# EAGLE design pH-meter-v1-4 (EAGLE 6.2)
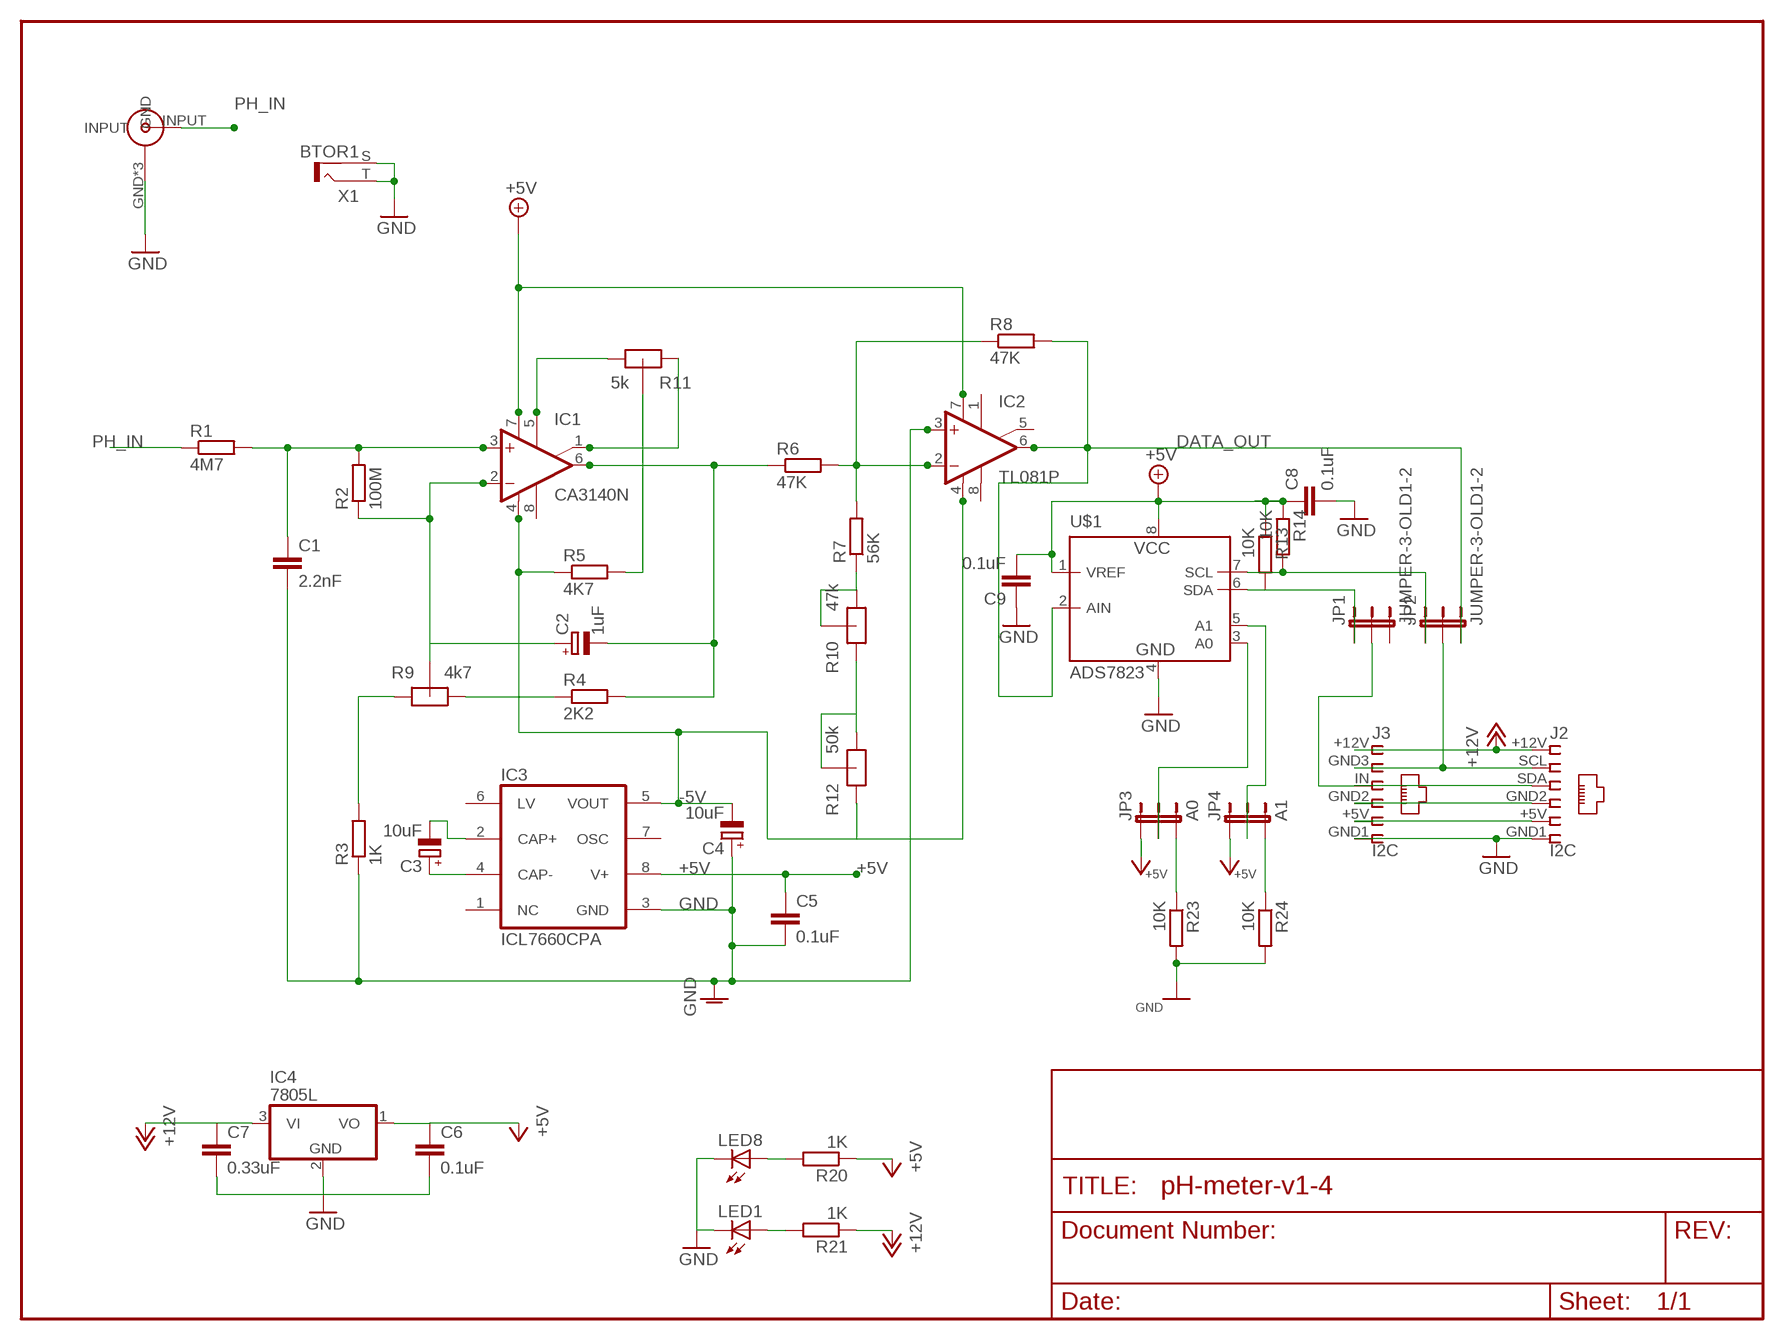
[diagram p0: schematic, sheet 1]

## Parts
C1  2.2nF  C-EU025-030X050  [C025-030X050]
C2  1uF  CPOL-EUE2-4  [E2-4]
C3  10uF  CPOL-EUE2-4  [E2-4]
C4  10uF  CPOL-EUE2-4  [E2-4]
C5  0.1uF  C-EU025-030X050  [C025-030X050]
C6  0.1uF  C-EU025-030X050  [C025-030X050]
C7  0.33uF  C-EU025-030X050  [C025-030X050]
C8  0.1uF  C-EU025-030X050  [C025-030X050]
C9  0.1uF  C-EU025-030X050  [C025-030X050]
IC1  CA3140N  [DIL08]
IC2  TL081P  [DIL08]
IC3  ICL7660CPA  [DIL08]
IC4  7805L  [TO92]
J2  I2C  RJ12STRAIGHT-I2C  [RJ12-STRAIGHT-I2C]
J3  I2C  RJ12STRAIGHT-ANALOG  [RJ12-STRAIGHT-ANALOG]
JP1  JUMPER-3-OLD1-2  [SJ_3_PASTE1&2]
JP2  JUMPER-3-OLD1-2  [SJ_3_PASTE1&2]
JP3  A0  JUMPER-3-OLD1-2  [SJ_3_PASTE1&2]
JP4  A1  JUMPER-3-OLD1-2  [SJ_3_PASTE1&2]
LED1  LED3MM  [LED3MM]
LED8  LED3MM  [LED3MM]
R1  4M7  R-EU_0309/12  [0309/12]
R2  100M  R-EU_0309/12  [0309/12]
R3  1K  R-EU_0309/12  [0309/12]
R4  2K2  R-EU_0309/12  [0309/12]
R5  4K7  R-EU_0309/12  [0309/12]
R6  47K  R-EU_0309/12  [0309/12]
R7  56K  R-EU_0309/12  [0309/12]
R8  47K  R-EU_0309/12  [0309/12]
R9  4k7  POT-METER_ALPS  [POT-METER_ALPS]
R10  47k  POT-METER_ALPS  [POT-METER_ALPS]
R11  5k  POT-METER_ALPS  [POT-METER_ALPS]
R12  50k  POT-METER_ALPS  [POT-METER_ALPS]
R13  10K  R-EU_R1206  [R1206]
R14  10K  R-EU_R1206  [R1206]
R20  1K  R-EU_0309/12  [0309/12]
R21  1K  R-EU_0309/12  [0309/12]
R23  10K  R-EU_0309/12  [0309/12]
R24  10K  R-EU_0309/12  [0309/12]
U$1  ADS7823  [MSOP8]
U$2  BNC_IN  BND_VERTICAL_AMPHENOL  [BNC_VERTICAL_AMPHENOL]
X1  BTOR1  [BTOR1]

## Nets
+5V: C5.1 C6.1 C8.1 C9.2 IC1.7(V+) IC2.7(V+) IC3.8(V+) IC4.1(VO) JP3.1 JP4.1 R13.1 R14.1 R20.1 U$1.1(VREF) U$1.8(VCC)
+12V [highpower]: C7.1 IC4.3(VI) J2.+12V J3.+12V R21.1
-5V: C4.- IC1.4(V-) IC2.4(V-) IC3.5(VOUT) R5.1 R12.P$1(IN)
ASDF: R3.2 R9.P$1(IN)
DATA_OUT [smd]: IC2.6(OUT) JP2.3 R8.2 U$1.2(AIN)
GND [highpower]: C1.2 C4.+ C5.2 C6.2 C7.2 C8.2 C9.1 IC2.3(+IN) IC3.3(GND) IC4.2(GND) J2.GND1 J2.GND2 J3.GND1 J3.GND2 LED1.K(C) LED8.K(C) R3.1 R23.2 R24.2 U$1.4(GND) U$2.GND U$2.GND_1(GND) U$2.GND_2(GND) X1.S X1.T
N$1: C1.1 IC1.3(+IN) R1.2 R2.2
N$2: C2.+ IC1.2(-IN) R2.1 R9.P$2(DRIVE)
N$3: R5.2 R11.P$2(DRIVE)
N$4: IC1.5(ON) R11.P$3(OUT)
N$5: IC1.1(ON/CMP) R11.P$1(IN)
N$6: C2.- IC1.6(OUT) R4.2 R6.1
N$7: R4.1 R9.P$3(OUT)
N$8: R7.1 R10.P$2(DRIVE) R10.P$3(OUT)
N$10: R10.P$1(IN) R12.P$2(DRIVE) R12.P$3(OUT)
N$11: C3.- IC3.2(CAP+)
N$12: IC2.2(-IN) R6.2 R7.2 R8.1
N$13: C3.+ IC3.4(CAP-)
N$14 [smd]: JP1.1 R13.2 U$1.6(SDA)
N$15 [smd]: JP2.1 R14.2 U$1.7(SCL)
N$18 [smd]: JP3.3 R23.1
N$19 [smd]: JP4.3 R24.1
N$20: LED8.A R20.2
N$21 [smd]: JP3.2 U$1.3(A0)
N$22 [smd]: JP4.2 U$1.5(A1)
N$23: LED1.A R21.2
PH_IN: R1.1 U$2.INPUT
RJ12-5V [highpower]: J2.+5V J3.+5V
SCL [smd]: J2.SCL J3.GND3 JP2.2
SDA [smd]: J2.SDA J3.IN JP1.2
Unconnected: IC1.8(CMP) IC2.1(ON1) IC2.5(ON2) IC2.8(OPT) IC3.1(NC) IC3.6(LV) IC3.7(OSC) JP1.3 X1.S@1 X1.S@2 X1.S@3

## Library data of the parts
C1 C5-C9 = resistor:C-EU: CAPACITOR, European symbol
C2-C4 = resistor:CPOL-EU: POLARIZED CAPACITOR, European symbol
IC1 = linear:CA3140: OP AMP
IC2 = linear:TL081: OP AMP
IC3 = maxim:ICL7660CPA: VOLTAGE CONVERTER; MF: INTERSIL; MPN: ICL7660CPA; OC_FARNELL: 1018170; OC_NEWARK: 06F7441
IC4 = linear:78*: Positive VOLTAGE REGULATOR Source: http://cache.national.com/ds/LM/LM78L05.pdf http://www.fairchildsemi.com/ds/LM/LM7805.pdf
J2 J3 = lpatiny:RJ12: CORCOM Modular RJ Jacks No Shield Source: www.tycoelectronics.com .. ENG_DS_1654001_1099_RJ_L_0507.pdf
JP1-JP4 = SparkFun:JUMPER-3-OLD
LED1 LED8 = lpatiny:LED3MM
R1-R8 R13 R14 R20 R21 R23 R24 = rcl:R-EU_: RESISTOR, European symbol
R9-R12 = lpatiny:POT-METER_ALPS
U$1 = lpatiny:ADS7823
U$2 = lpatiny:BND_VERTICAL_AMPHENOL
X1 = con-lumberg:BTOR1: RCA connectors according to JEITA RC-5231 Cinch RCA-Einbaukupplung nach JEITA RC-5231, stehende Ausführung Source: http://www.lumberg.de/Produkte/PDFs/BTOR1.pdf; MPN: BTOR 1; OC_FARNELL: 1217030; OC_NEWARK: 96K7172

## Net classes
0 default: width 0.457 mm
1 smd: width 0.203 mm
2 highpower: width 0.61 mm

## Board
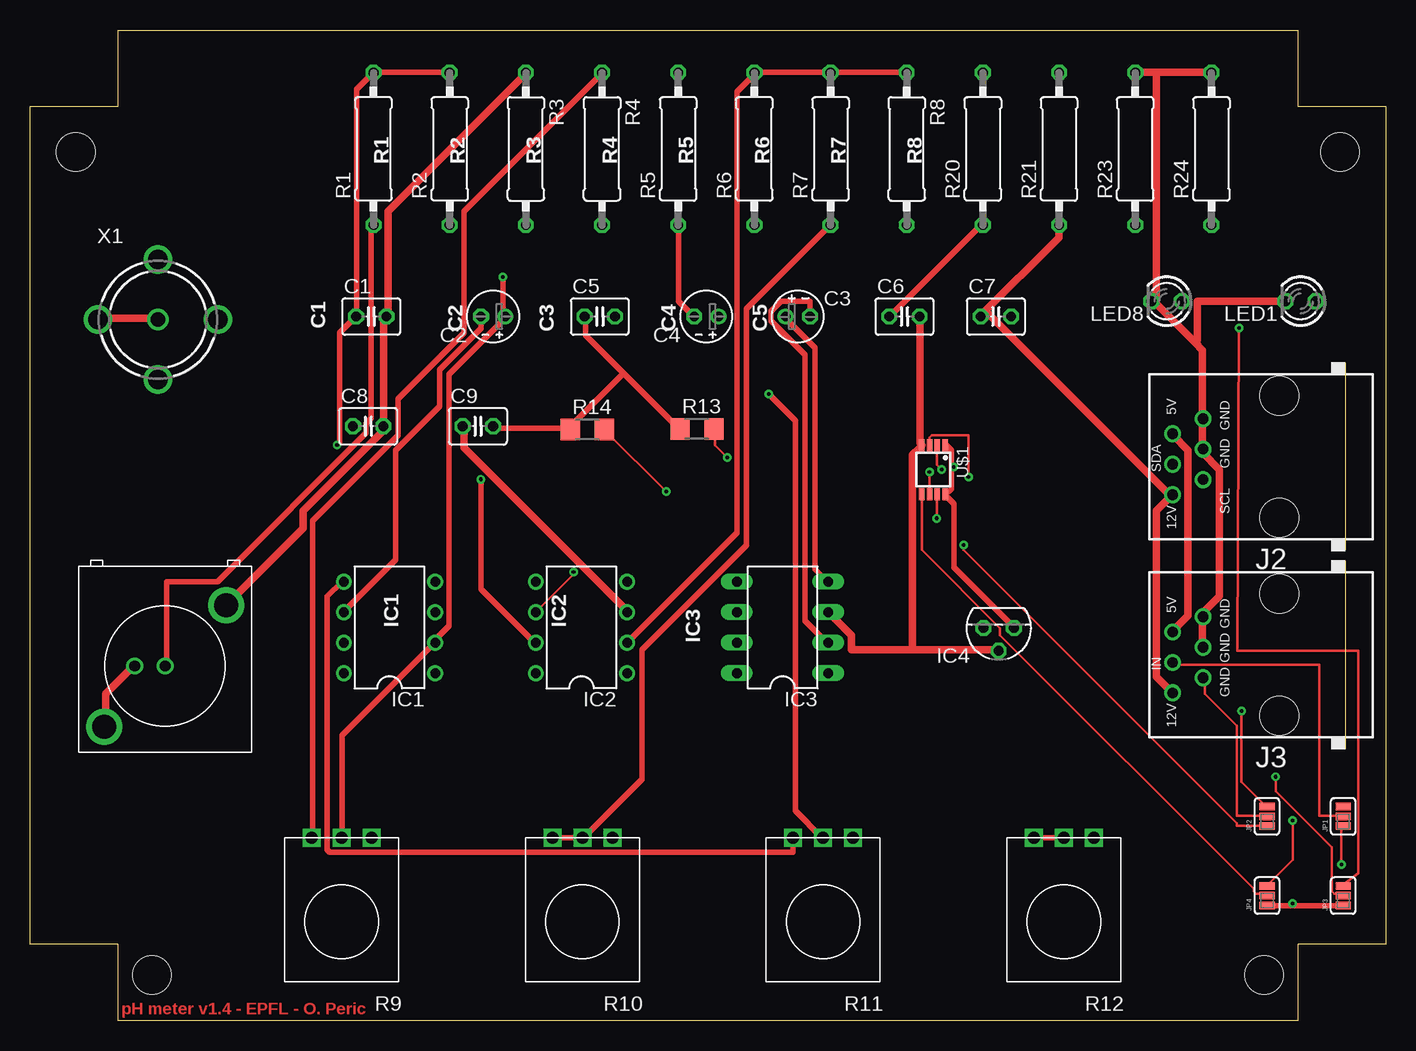
[diagram p1: board, top side]
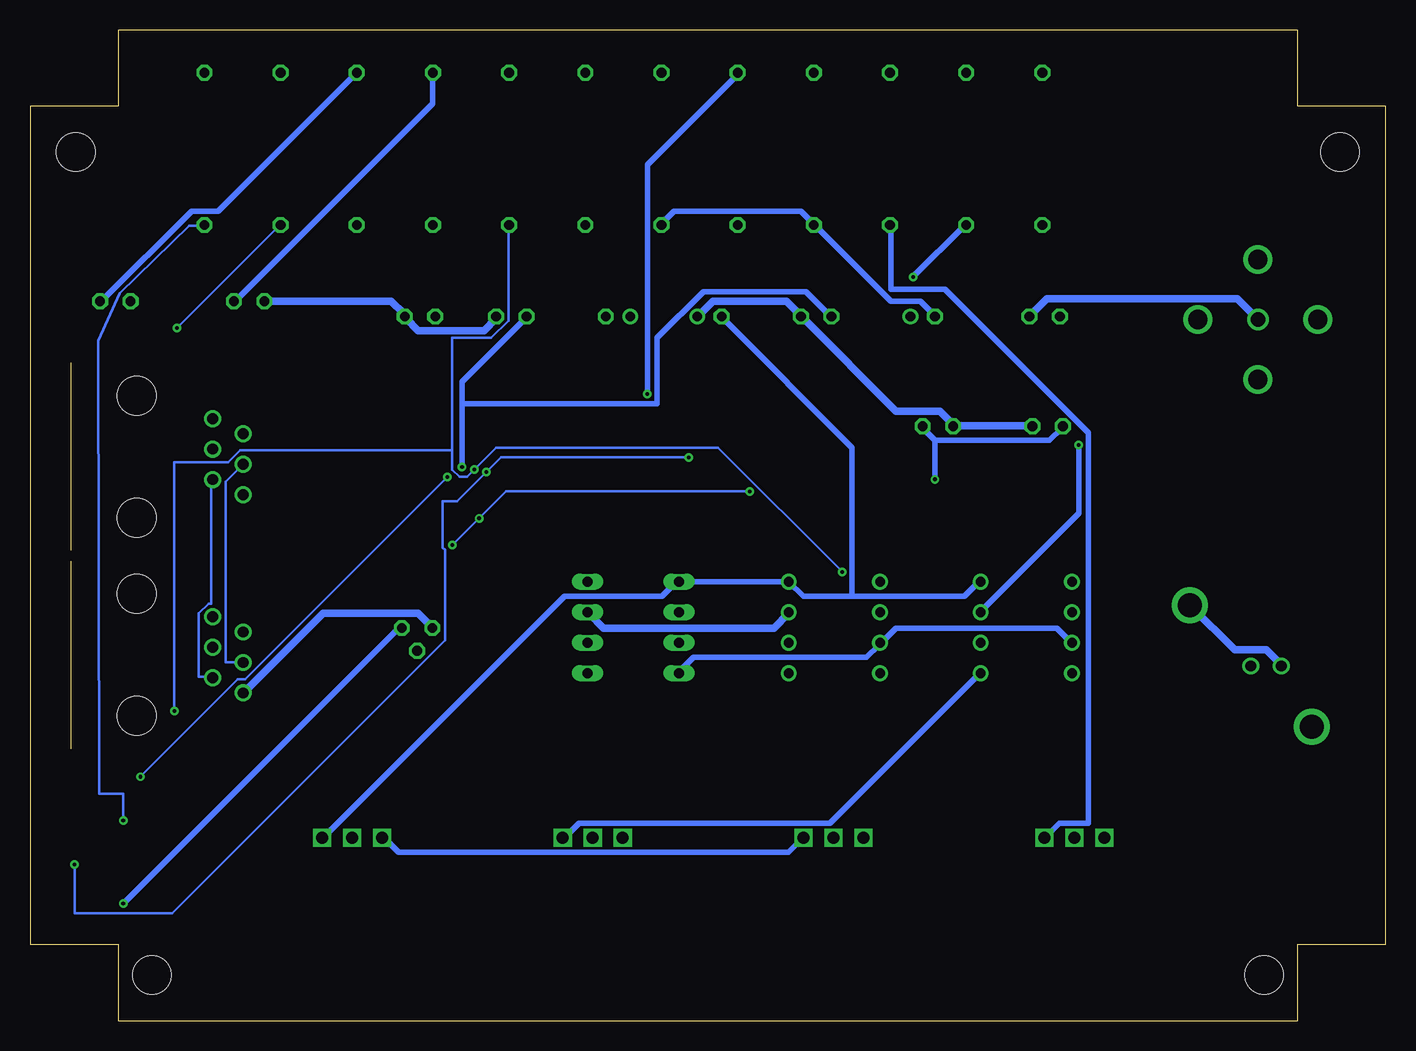
[diagram p2: board, bottom side, seen from below]

Size 113.03 x 82.55 mm. Coordinates in mm from the lower left corner, seen from the top.
Outline: 0,76.2 7.35,76.2 7.35,82.55 105.68,82.55 105.68,76.2 113.03,76.2 113.03,6.35 105.68,6.35 105.68,0 7.35,0 7.35,6.35 0,6.35 0,76.2
Copper layers (1*16): Top 0.035mm / dielectric 1.5mm / Bottom 0.035mm
Design rules: minimum track width 0.15mm, minimum drill 0.3mm, track to track 0.2mm, track to pad 0.2mm, pad to pad 0.2mm, via to via 0.2mm, smd to smd 0.2mm, copper to edge 1mm, drill to drill 0.3mm, minimum pad ring 10mil, minimum via ring 8mil, stop-mask expansion 1mil, vias tented up to drill 0mil, thermal gap 10mil
Holes 3.2 mm at 3.81,72.39 10.16,3.81 102.87,3.81 109.22,72.39
Milling: 12 lines

### Footprints (pad centres in the part's own frame; a part is rotated, then mirrored left to right if it is on the bottom)
C025-030X050 = drill 0.813 octagon: 1 -1.27,0; 2 1.27,0
E2-4 = drill 0.813 pad 1.27: + -1.016,0 | drill 0.813 pad 1.27 octagon: - 1.016,0
DIL08 = drill 0.813 pad 1.27: 1 -3.81,-3.81; 2 -1.27,-3.81; 3 1.27,-3.81; 4 3.81,-3.81; 5 3.81,3.81; 6 1.27,3.81; 7 -1.27,3.81; 8 -3.81,3.81
DIL08' = drill 0.813 long: 1 -3.81,-3.81; 2 -1.27,-3.81; 3 1.27,-3.81; 4 3.81,-3.81; 5 3.81,3.81; 6 1.27,3.81; 7 -1.27,3.81; 8 -3.81,3.81
TO92 = drill 0.813 octagon: 1 -1.27,0; 2 0,1.905; 3 1.27,0
RJ12-STRAIGHT-I2C = drill 0.9 pad 1.4: +5V 1.905,8.89; +12V -3.175,8.89; GND1 3.175,6.35; GND2 0.635,6.35; SCL -1.905,6.35; SDA -0.635,8.89 | hole 3.251: -5.08,0; 5.08,0
RJ12-STRAIGHT-ANALOG = drill 0.9 pad 1.4: +5V 1.905,8.89; +12V -3.175,8.89; GND1 3.175,6.35; GND2 0.635,6.35; GND3 -1.905,6.35; IN -0.635,8.89 | hole 3.251: -5.08,0; 5.08,0
SJ_3_PASTE1&2 = smd 0.635 x 1.27: 1 -0.813,0; 2 0,0; 3 0.813,0
LED3MM = drill 0.813 octagon: A -1.27,0; K 1.27,0
0309/12 = drill 0.813 octagon: 1 -6.35,0; 2 6.35,0
POT-METER_ALPS = drill 1 square: P$1 2.25,0; P$2 4.75,0; P$3 7.25,0
R1206 = smd 1.6 x 1.803: 1 -1.422,0; 2 1.422,0
MSOP8 = smd 0.45 x 1: 1 -0.975,-2.05; 2 -0.325,-2.05; 3 0.325,-2.05; 4 0.975,-2.05; 5 0.975,2.05; 6 0.325,2.05; 7 -0.325,2.05; 8 -0.975,2.05
BNC_VERTICAL_AMPHENOL = drill 0.9: GND 4.66,7.2; INPUT 7.2,7.2 | drill 2: GND_1 12.28,12.28; GND_2 2.12,2.12
BTOR1 = drill 1.6 pad 2.2: S -5,0; S@1 0,5; S@2 5,0; S@3 0,-5 | drill 1.2 pad 1.6: T 0,0

### Placement (x,y rotation side)
C1  28.45,58.67 0 top
C2  38.61,58.67 180 top
C3  64.01,58.67 0 top
C4  56.39,58.67 180 top
C5  47.5,58.67 0 top
C6  72.9,58.67 0 top
C7  80.52,58.67 0 top
C8  28.19,49.53 0 top
C9  37.34,49.53 0 top
IC1  29.97,32.77 90 top
IC2  45.97,32.77 90 top
IC3  ICL7660CPA  [DIL08']  62.74,32.77 90 top
IC4  80.76,32.72 180 top
J2  104.14,46.99 90 top
J3  104.14,30.48 90 top
JP1  109.47,17.02 90 top
JP2  103.12,17.02 90 top
JP3  109.47,10.41 90 top
JP4  103.12,10.41 90 top
LED1  105.92,59.94 180 top
LED8  94.76,59.94 180 top
R1  28.64,72.64 90 top
R2  34.99,72.64 90 top
R3  41.34,72.64 270 top
R4  47.69,72.64 270 top
R5  54.04,72.64 90 top
R6  60.39,72.64 90 top
R7  66.74,72.64 90 top
R8  73.09,72.64 270 top
R9  30.73,15.24 180 top
R10  50.8,15.24 180 top
R11  70.87,15.24 180 top
R12  90.93,15.24 180 top
R13  55.6,49.3 0 top
R14  46.46,49.26 0 top
R20  79.44,72.64 90 top
R21  85.79,72.64 90 top
R23  92.14,72.64 90 top
R24  98.49,72.64 90 top
U$1  75.31,45.91 180 top
U$2  4.06,22.35 0 top
X1  10.67,58.42 0 top

### Tracks (layer width: path | path; a pad name or v marks a point on that pad's centre or on a via)
+5V  (via drill 0.3)
  Top 0.457: 49.48,53.95 46.33,57.1 46.33,58.52 C5.1 | 49.48,53.95 54.05,49.38 R13.1 | C9.2 38.61,49.38 44.91,49.38 R14.1 45.11,49.38 45.11,49.58 49.38,53.85 49.48,53.95 | v37.59,45.11 37.59,35.97 42.06,31.5 IC2.7 | C6.1 71.73,58.73 79.25,66.24 R20.1 | 105.26,9.55 109.32,9.55 JP3.1 | 105.26,9.55 103.23,9.55 JP4.1 | 76.81,46.13 76.81,47.55 76.4,47.95 U$1.1 | 76.81,46.13 76.81,44.3 76.4,43.89 U$1.8 76.4,43.69 77.01,43.08 77.01,37.8 81.89,32.92 IC4.1 | v105.26,9.75 105.26,9.55 | v77.01,46.13 76.81,46.13
  Bottom 0.457: IC1.7 26.21,31.5 27.43,32.72 40.84,32.72 42.06,31.5 IC2.7 42.27,31.29 43.28,30.28 57.71,30.28 58.93,29.06 IC3.8 | 37.59,48.36 28.04,48.36 27.03,49.38 C8.1 | 37.59,48.36 38.61,49.38 C9.2 | v37.59,45.11 37.59,48.16 37.59,48.36 | v105.26,9.75 82.3,32.72 82.09,32.72 IC4.1 | v77.01,46.13 77.01,51.41 | 77.01,51.41 77.01,53.24 71.73,58.52 C6.1 | C5.1 46.33,58.73 48.36,60.76 56.9,60.76 60.76,56.9 60.76,51.41 76.81,51.41 77.01,51.41
+12V
  Top 0.61: R21.1 85.75,66.24 85.75,65.23 79.25,58.73 C7.1 79.86,58.93 94.89,43.89 J2.+12V 95.1,43.69 93.88,42.47 93.88,28.65 95.1,27.43 J3.+12V
  Bottom 0.61: IC4.3 79.65,32.92 80.67,33.93 88.59,33.93 95.1,27.43 J3.+12V
-5V
  Top 0.457: C4.- 55.27,58.73 54.05,59.94 54.05,66.24 R5.1
  Bottom 0.457: 44.5,35.36 48.56,35.36 IC2.4 49.99,36.58 IC3.5 59.13,36.58 60.35,35.36 68.48,35.36 88.59,15.24 R12.P$1 | 44.5,35.36 35.15,35.36 33.93,36.58 IC1.4 | C4.- 55.27,58.52 44.5,47.75 44.5,35.56 44.5,35.36
ASDF
  Bottom 0.457: R3.2 41.25,66.24 41.25,60.96 36.78,60.96 24.79,48.97 24.79,16.46 27.23,16.46 28.45,15.24 R9.P$1
DATA_OUT  (via drill 0.3)
  Top 0.203: v76,45.92 75.59,46.33 75.59,47.95 U$1.2 | v100.99,25.81 100.99,19.91 103.02,17.88 JP2.3 | v45.31,37.39 45.31,37.19 42.27,34.14 IC2.6
  Bottom 0.203: 77.83,47.55 77.83,56.9 74.57,56.9 73.15,58.32 73.15,66.24 R8.2 | 77.83,47.55 77.83,45.92 77.22,45.31 76.61,45.31 v76,45.92 74.17,47.75 55.68,47.75 v45.31,37.39 | v100.99,25.81 100.99,46.53 96.52,46.53 95.5,47.55 77.83,47.55
GND
  Top 0.61: 73.56,30.89 68.48,30.89 68.48,32.11 66.65,33.93 IC3.3 | 73.56,30.89 80.67,30.89 IC4.2 | C6.2 74.17,58.52 74.17,48.16 U$1.4 74.17,47.75 73.56,47.14 73.56,31.09 73.56,30.89 | 93.88,79.05 98.35,79.05 R24.2 | 93.88,79.05 92.25,79.05 R23.2 | J3.GND2 97.74,31.29 97.74,33.53 J3.GND1 97.74,33.93 99.16,35.36 99.16,45.92 97.74,47.35 J2.GND2 97.74,47.75 97.74,49.99 J2.GND1 97.74,50.19 97.74,55.88 97.13,56.49 | 97.13,56.49 93.67,59.94 LED8.K 93.88,60.15 93.88,78.84 93.88,79.05 | LED1.K 97.33,59.94 97.33,56.69 97.13,56.49 | U$2.GND 8.53,29.46 6.3,27.23 6.3,24.59 U$2.GND_2 | X1.T 10.57,58.52 5.69,58.52 X1.S | R3.1 41.25,78.84 29.87,67.46 29.87,58.93 C1.2 29.67,58.52 29.46,58.32 29.46,49.58 C8.2 29.26,49.38 29.26,48.97 22.76,42.47 22.76,41.05 16.46,34.75 U$2.GND_1 | IC2.3 49.78,34.14 36.17,47.75 36.17,49.38 C9.1
  Bottom 0.61: IC2.3 49.78,33.93 51,32.72 65.23,32.72 66.45,33.93 IC3.3 | C6.2 74.17,58.52 75.18,57.51 80.67,57.51 81.69,58.52 C7.2 81.89,58.93 82.91,59.94 93.47,59.94 LED8.K | U$2.GND_1 16.26,34.54 12.6,30.89 9.96,30.89 8.74,29.67 U$2.GND | C4.+ 57.3,58.73 56.08,59.94 49.99,59.94 48.77,58.73 C5.2 48.56,58.52 40.84,50.8 37.19,50.8 36.17,49.78 C9.1 35.97,49.58 29.46,49.58 C8.2 | X1.T 10.77,58.52 12.39,60.15 28.25,60.15 29.67,58.73 C1.2
N$1  (via drill 0.3)
  Top 0.457: R2.2 34.95,79.05 28.65,79.05 R1.2 28.45,78.84 27.23,77.62 27.23,58.73 C1.1 27.03,58.52 25.81,57.3 25.81,48.16 v25.6,47.95
  Bottom 0.457: v25.6,47.95 25.6,42.27 33.73,34.14 IC1.3
N$2  (via drill 0.3)
  Top 0.457: R9.P$2 26.01,15.24 26.01,23.77 33.73,31.5 IC1.2 33.73,31.7 34.95,32.92 34.95,53.85 39.62,58.52 C2.+ 39.42,58.73 v39.42,61.98
  Bottom 0.457: v39.42,61.98 35.15,66.24 R2.1
N$3  (via drill 0.3)
  Top 0.457: v61.57,52.22 63.8,49.99 63.8,17.48 66.04,15.24 R11.P$2
  Bottom 0.457: v61.57,52.22 61.57,71.32 54.05,78.84 R5.2
N$4
  Top 0.457: IC1.5 26.01,36.58 24.79,35.36 24.79,14.22 24.99,14.02 63.6,14.02 63.6,15.24 R11.P$3
N$5
  Bottom 0.457: IC1.1 33.93,28.85 46.33,16.46 67.26,16.46 68.48,15.24 R11.P$1
N$6
  Top 0.457: IC1.6 26.21,34.14 30.48,38.41 30.48,47.55 34.14,51.21 34.14,54.25 37.59,57.71 37.59,58.52 C2.-
  Bottom 0.457: R6.1 60.35,66.45 59.33,67.46 48.77,67.46 47.75,66.45 R4.2 47.55,66.24 41.25,59.94 38.81,59.94 37.59,58.73 C2.-
N$7
  Top 0.457: R4.1 47.55,78.84 36.17,67.46 36.17,57.3 30.68,51.82 30.68,48.77 23.57,41.66 23.57,15.24 R9.P$3
N$8
  Top 0.457: R7.1 66.65,66.24 59.74,59.33 59.74,39.62 51,30.89 51,20.12 46.13,15.24 R10.P$2 45.92,15.24 43.69,15.24 R10.P$3
N$10
  Top 0.457: R12.P$2 86.16,15.24 83.72,15.24 R12.P$3
  Bottom 0.457: R10.P$1 48.56,15.24 49.78,14.02 82.3,14.02 83.52,15.24 R12.P$3
N$11
  Top 0.457: IC3.2 66.45,31.5 64.62,33.33 64.62,55.47 61.77,58.32 61.77,59.13 62.59,59.94 65.02,59.94 65.02,58.73 C3.-
N$12
  Top 0.457: R8.1 72.95,79.05 66.85,79.05 R7.2 66.65,79.05 60.55,79.05 R6.2 60.35,78.84 58.93,77.42 58.93,40.64 IC2.2
N$13
  Top 0.457: IC3.4 66.45,36.58 65.43,37.59 65.43,56.08 62.99,58.52 C3.+
N$14  (via drill 0.3)
  Top 0.203: v74.98,45.72 74.98,43.89 U$1.6 | v58.12,46.94 57.1,47.95 57.1,49.17 R13.2 | v109.32,13.01 109.32,16.05 JP1.1
  Bottom 0.203: v58.12,46.94 73.76,46.94 v74.98,45.72 77.42,43.28 78.64,43.28 78.64,39.42 78.44,39.22 78.44,31.7 101.19,8.94 109.32,8.94 v109.32,13.01
N$15  (via drill 0.3)
  Top 0.203: v75.59,41.86 75.59,43.69 U$1.7 | v53.03,44.09 47.95,49.17 R14.2 | v77.83,39.62 77.83,39.22 100.58,16.46 100.58,16.26 103.02,16.26 JP2.1
  Bottom 0.203: v53.03,44.09 73.36,44.09 v75.59,41.86 v77.83,39.62
N$18  (via drill 0.3)
  Top 0.203: v100.79,57.71 100.64,30.82 110.74,30.82 110.74,12.29 109.53,11.38 JP3.3
  Bottom 0.203: v100.79,57.71 92.25,66.24 R23.1
N$19  (via drill 0.3)
  Top 0.203: v105.26,16.66 105.26,13.41 103.23,11.38 JP4.3
  Bottom 0.203: v105.26,16.66 105.26,18.9 107.26,18.9 107.35,56.66 105.56,60.6 99.77,66.24 98.55,66.24 R24.1
N$20
  Bottom 0.457: LED8.A 95.91,59.94 79.45,76.4 79.45,78.84 R20.2
N$21  (via drill 0.3)
  Top 0.203: v78.23,45.31 78.23,48.77 75.18,48.77 74.98,48.56 74.98,48.16 U$1.3 | v103.83,20.32 103.83,19.1 108.51,14.43 108.51,10.77 108.71,10.57 109.32,10.57 JP3.2
  Bottom 0.203: v78.23,45.31 95.1,28.45 95.71,28.45 v103.83,20.32
N$22
  Top 0.203: U$1.5 74.37,43.69 74.37,39.22 80.87,32.72 80.87,32.11 102.01,10.97 102.01,10.77 102.21,10.57 103.02,10.57 JP4.2
N$23
  Bottom 0.457: R21.2 85.95,78.84 97.33,67.46 99.57,67.46 107.09,59.94 LED1.A
PH_IN
  Top 0.457: R1.1 28.45,66.24 28.45,50.19 28.04,49.78 28.04,48.97 15.65,36.58 11.38,36.58 11.38,29.67 U$2.INPUT
RJ12-5V
  Top 0.61: J3.+5V 95.3,32.51 96.52,33.73 96.52,47.55 95.3,48.77 J2.+5V
SCL
  Top 0.203: JP2.2 103.02,17.07 100.58,17.07 100.58,24.59 97.94,27.23 97.94,28.45 J3.GND3
  Bottom 0.203: J2.SCL 97.94,44.91 97.94,34.75 98.15,34.75 98.96,33.93 98.96,28.65 97.94,28.65 J3.GND3
SDA
  Top 0.203: JP1.2 109.32,17.07 107.49,17.07 107.49,29.67 100.15,29.67 95.3,29.67 J3.IN
  Bottom 0.203: J2.SDA 95.3,46.33 96.72,44.91 96.72,29.87 95.3,29.87 J3.IN

### Text on the board
Top: pH meter v1.4 - EPFL - O. Peric
tPlace: R1 | R2 | R3 | R4 | R5 | R6 | R7 | R8 | C1 | C2 | C3 | C4 | C5 | IC1 | IC2 | IC3